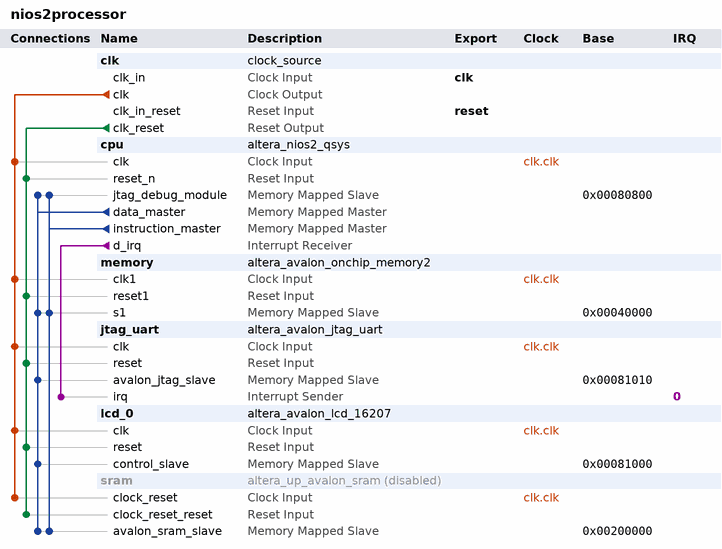
[diagram p0: system contents]
# Platform Designer (Qsys) system nios2processor
# Parameters at their usual value, and those the tool derives, are not listed.
package require -exact qsys 11.0
create_system nios2processor
set_project_property DEVICE_FAMILY CYCLONEIVE

add_instance clk clock_source 11.0
set_instance_parameter_value clk clockFrequency 50000000

add_instance cpu altera_nios2_qsys 11.0
set_instance_parameter_value cpu manuallyAssignCpuID false
set_instance_parameter_value cpu resetSlave memory.s1
set_instance_parameter_value cpu exceptionSlave memory.s1
set_instance_parameter_value cpu breakSlave cpu.jtag_debug_module
set_instance_parameter_value cpu impl Fast
set_instance_parameter_value cpu icache_size 4096

add_instance memory altera_avalon_onchip_memory2 11.0
set_instance_parameter_value memory dataWidth 32
set_instance_parameter_value memory dualPort false
set_instance_parameter_value memory initMemContent true
set_instance_parameter_value memory initializationFileName memory
set_instance_parameter_value memory memorySize 204800

add_instance jtag_uart altera_avalon_jtag_uart 11.0
set_instance_parameter_value jtag_uart simInteractiveOptions INTERACTIVE_ASCII_OUTPUT

add_instance lcd_0 altera_avalon_lcd_16207 11.0

add_instance sram altera_up_avalon_sram 11.0
set_instance_property sram ENABLED false
set_instance_parameter_value sram board DE2-115
set_instance_parameter_value sram pixel_buffer false

# connections
add_connection clk.clk cpu.clk clock
add_connection clk.clk jtag_uart.clk clock
add_connection clk.clk lcd_0.clk clock
add_connection clk.clk memory.clk1 clock
add_connection clk.clk sram.clock_reset clock
add_connection clk.clk_reset cpu.reset_n reset
add_connection clk.clk_reset jtag_uart.reset reset
add_connection clk.clk_reset lcd_0.reset reset
add_connection clk.clk_reset memory.reset1 reset
add_connection clk.clk_reset sram.clock_reset_reset reset
add_connection cpu.data_master cpu.jtag_debug_module avalon
set_connection_parameter_value cpu.data_master/cpu.jtag_debug_module baseAddress 0x00080800
add_connection cpu.data_master jtag_uart.avalon_jtag_slave avalon
set_connection_parameter_value cpu.data_master/jtag_uart.avalon_jtag_slave baseAddress 0x00081010
add_connection cpu.data_master lcd_0.control_slave avalon
set_connection_parameter_value cpu.data_master/lcd_0.control_slave baseAddress 0x00081000
add_connection cpu.data_master memory.s1 avalon
set_connection_parameter_value cpu.data_master/memory.s1 baseAddress 0x00040000
add_connection cpu.data_master sram.avalon_sram_slave avalon
set_connection_parameter_value cpu.data_master/sram.avalon_sram_slave baseAddress 0x00200000
add_connection cpu.instruction_master cpu.jtag_debug_module avalon
set_connection_parameter_value cpu.instruction_master/cpu.jtag_debug_module baseAddress 0x00080800
add_connection cpu.instruction_master memory.s1 avalon
set_connection_parameter_value cpu.instruction_master/memory.s1 baseAddress 0x00040000
add_connection cpu.instruction_master sram.avalon_sram_slave avalon
set_connection_parameter_value cpu.instruction_master/sram.avalon_sram_slave baseAddress 0x00200000
add_connection cpu.d_irq jtag_uart.irq interrupt
set_connection_parameter_value cpu.d_irq/jtag_uart.irq irqNumber 0

# exported interfaces
add_interface clk clock sink
set_interface_property clk EXPORT_OF clk.clk_in
add_interface reset reset sink
set_interface_property reset EXPORT_OF clk.clk_in_reset

save_system nios2processor.qsys
